# Altium schematic sheet micro.SchDoc
size A4; SheetNumber: 1; SheetTotal: 2; SPICEModelCacheOPHJYIUV: <root> / <DocumentId>OPHJYIUV</DocumentId> / <CacheFrame Number="0"> / <Model Name="cap" Kind="MDL"> / <Text>*Default semiconductor capacitor / .MODEL CAP C()</Text> / </Model> / </CacheFrame> / </root>
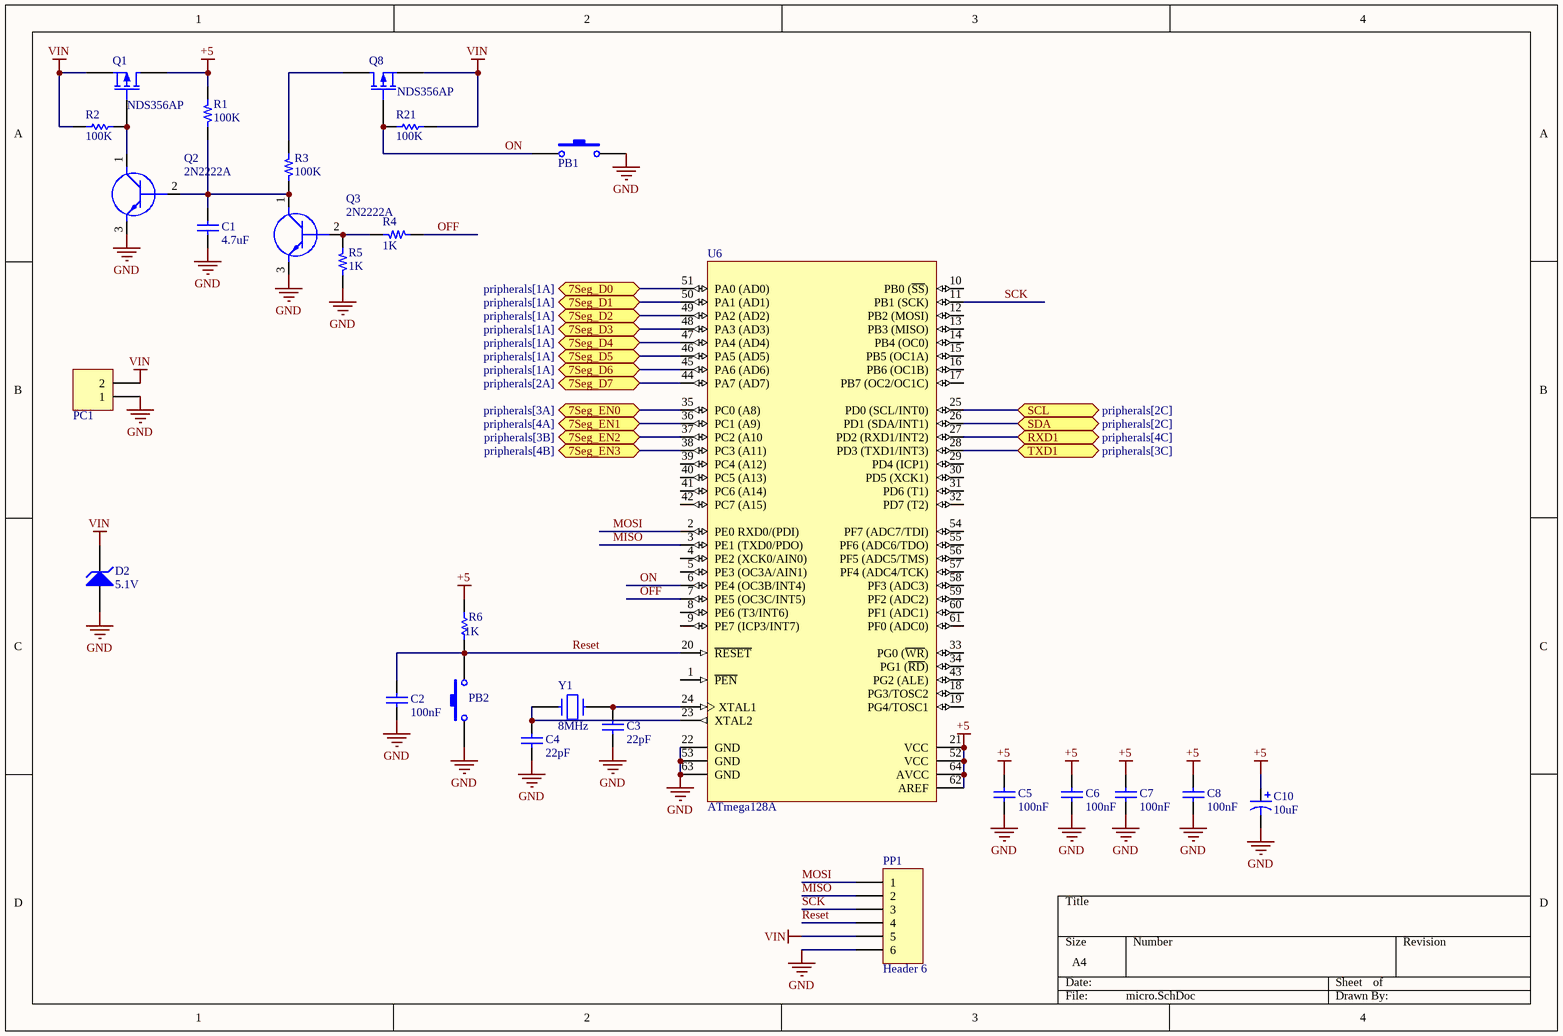
[diagram p0: micro.SchDoc]

## Parts
C1  value 4.7uF  [CAP0805]  (hidden comment: cap 4.7uF)
C2  value 100nF  [CAP0805]  (hidden comment: cap 100nF)
C3  value 22pF  [CAP0805]  (hidden comment: cap 22pF)
C4  value 22pF  [CAP0805]  (hidden comment: cap 22pF)
C5  value 100nF  [CAP0805]  (hidden comment: cap 100nF)
C6  value 100nF  [CAP0805]  (hidden comment: cap 100nF)
C7  value 100nF  [CAP0805]  (hidden comment: cap 100nF)
C8  value 100nF  [CAP0805]  (hidden comment: cap 100nF)
C10  value 10uF  [CAP0805]  (hidden comment: cap 10uF)
D2  5.1V  [Diode 1n4148 SMD]
PB1  Push-Button-tall  [tact-12mm]  (value not drawn)
PB2  Push-Button-tall  [tack-sw-3x5x6]  (value not drawn)
PC1  Power Connector  [My_ Power_Connector]  (value not drawn)
PP1  Header 6  [HDR1X6]
Q1  NDS356AP  [soT95p280x130-3n]
Q2  2N2222A  [soT95p280x130-3n]
Q3  2N2222A  [soT95p280x130-3n]
Q8  NDS356AP  [soT95p280x130-3n]
R1  100K  [RES0805]
R2  value 100K  [RES0805]  (hidden comment: Res 100K)
R3  100K  [RES0805]
R4  1K  [RES0805]
R5  1K  [RES0805]
R6  value 1K  [RES0805]  (hidden comment: Res 1K)
R21  value 100K  [RES0805]  (hidden comment: Res 100K)
U6  ATmega128A  [TQFP64_N]
Y1  8MHz  [My_Crystal]

## Ports
7Seg_D0 (bidir, see pripherals[1A]), 7Seg_D1 (bidir, see pripherals[1A]), 7Seg_D2 (bidir, see pripherals[1A]), 7Seg_D3 (bidir, see pripherals[1A]), 7Seg_D4 (bidir, see pripherals[1A]), 7Seg_D5 (bidir, see pripherals[1A]), 7Seg_D6 (bidir, see pripherals[1A]), 7Seg_D7 (bidir, see pripherals[2A]), 7Seg_EN0 (bidir, see pripherals[3A]), 7Seg_EN1 (bidir, see pripherals[4A]), 7Seg_EN2 (bidir, see pripherals[3B]), 7Seg_EN3 (bidir, see pripherals[4B]), RXD1 (bidir, see pripherals[4C]), SCL (bidir, see pripherals[2C]), SDA (bidir, see pripherals[2C]), TXD1 (bidir, see pripherals[3C])

## Nets
+5: C5.2 C6.2 C7.2 C8.2 C10.1 Q1.1(D) R1.1 R6.1 U6.21(VCC) U6.52(VCC) U6.62(AREF) U6.64(AVCC)
GND: C1.1 C2.1 C3.1 C4.1 C5.1 C6.1 C7.1 C8.1 C10.2 D2.1(A) PB1.2 PB2.1 PC1.1 PP1.6 Q2.3(E) Q3.3(E) R5.1 U6.22(GND) U6.53(GND) U6.63(GND)
VIN: D2.2(K) PC1.2 PP1.5 Q1.3(S) Q8.3(S) R2.1 R21.1
7Seg_D0: U6.51(PA0_(AD0)) ; port 7Seg_D0
7Seg_D1: U6.50(PA1_(AD1)) ; port 7Seg_D1
7Seg_D2: U6.49(PA2_(AD2)) ; port 7Seg_D2
7Seg_D3: U6.48(PA3_(AD3)) ; port 7Seg_D3
7Seg_D4: U6.47(PA4_(AD4)) ; port 7Seg_D4
7Seg_D5: U6.46(PA5_(AD5)) ; port 7Seg_D5
7Seg_D6: U6.45(PA6_(AD6)) ; port 7Seg_D6
7Seg_D7: U6.44(PA7_(AD7)) ; port 7Seg_D7
7Seg_EN0: U6.35(PC0_(A8)) ; port 7Seg_EN0
7Seg_EN1: U6.36(PC1_(A9)) ; port 7Seg_EN1
7Seg_EN2: U6.37(PC2_(A10) ; port 7Seg_EN2
7Seg_EN3: U6.38(PC3_(A11)) ; port 7Seg_EN3
MISO: PP1.2 U6.3(PE1_(TXD0/PDO))
MOSI: PP1.1 U6.2(PE0_RXD0/(PDI))
OFF: R4.1 U6.7(PE5_(OC3C/INT5))
ON: PB1.1 Q8.2(G) R21.2 U6.6(PE4_(OC3B/INT4))
Reset: C2.2 PB2.2 PP1.4 R6.2 U6.20(~{RESET})
RXD1: U6.27(PD2_(RXD1/INT2)) ; port RXD1
SCK: PP1.3 U6.11(PB1_(SCK))
SCL: U6.25(PD0_(SCL/INT0)) ; port SCL
SDA: U6.26(PD1_(SDA/INT1)) ; port SDA
TXD1: U6.28(PD3_(TXD1/INT3)) ; port TXD1
NetC1_2: C1.2 Q2.2(B) Q3.1(C) R1.2 R3.2
NetC3_2: C3.2 U6.24(XTAL1) Y1.2
NetC4_2: C4.2 U6.23(XTAL2) Y1.1
NetQ1_2: Q1.2(G) Q2.1(C) R2.2
NetQ3_2: Q3.2(B) R4.2 R5.2
NetQ8_1: Q8.1(D) R3.1

Not connected (* = marked no-connect by the designer): U6 1(~{PEN}) 4(PE2_(XCK0/AIN0)) 5(PE3_(OC3A/AIN1)) 8(PE6_(T3/INT6)) 9(PE7_(ICP3/INT7)) 10(PB0_(~{SS})) 12(PB2_(MOSI)) 13(PB3_(MISO)) 14(PB4_(OC0)) 15(PB5_(OC1A)) 16(PB6_(OC1B)) 17(PB7_(OC2/OC1C)) 18(PG3/TOSC2) 19(PG4/TOSC1) 29(PD4_(ICP1)) 30(PD5_(XCK1)) 31(PD6_(T1)) 32(PD7_(T2)) 33(PG0_(~{WR})) 34(PG1_(~{RD})) 39(PC4_(A12)) 40(PC5_(A13)) 41(PC6_(A14)) 42(PC7_(A15)) 43(PG2_(ALE)) 54(PF7_(ADC7/TDI)) 55(PF6_(ADC6/TDO)) 56(PF5_(ADC5/TMS)) 57(PF4_(ADC4/TCK)) 58(PF3_(ADC3)) 59(PF2_(ADC2)) 60(PF1_(ADC1)) 61(PF0_(ADC0))

## Library data of the parts
C1-C8 = Cap ceramic: CAP seramic
C10 = Cap Pol1: CAP seramic; Published: 8-Jun-2000; LatestRevisionDate: 17-Jul-2002; LatestRevisionNote: Re-released for DXP Platform.; PackageReference: RB7.6-15; Publisher: Altium Limited; PackageDescription: Polarized Capacitor (Radial); 2 Leads
D2 = D Zener: Zener Diode 5.1v; Published: 8-Jun-2000; LatestRevisionDate: 17-Jul-2002; LatestRevisionNote: Re-released for DXP Platform.; PackageReference: DIODE-0.7; Publisher: Altium Limited; PackageDescription: Diode, Thru-Hole; 2 Leads; 0.7 in Pin Spacing
PC1 = Power Connector: white Power Connector
PP1 = Header 6: Header, 6-Pin , female; LatestRevisionDate: 17-Jul-2002; LatestRevisionNote: Re-released for DXP Platform.; Publisher: Altium Limited
Q1 Q8 = MOSFET-P: P-Channel MOSFET SOT23; pin to pad: 1>3 2>1 3>2; Published: 8-Jun-2000; LatestRevisionDate: 17-Jul-2002; LatestRevisionNote: Re-released for DXP Platform.; PackageVersion: 1995/1996; PackageReference: E3; Publisher: Altium Limited; PackageDescription: TO, Flat Index; 3 In-Line, Axial Leads; Body Dia. 4.6mm; Lead Dia. 0.5 mm (max)
Q2 Q3 = 2N2222A: Transistor BJT NPN SMD; pin to pad: 1>3 2>1 3>2; Manufacturer_Name: Foshan Blue Rocket Elec; Datasheet Link: https://datasheet.lcsc.com/szlcsc/1901291437_Foshan-Blue-Rocket-Elec-2N2222A_C358533.pdf; Height: 4.7mm; Manufacturer_Part_Number: 2N2222A
R1 R3-R5 = Resistor: RES SMD 0603; Part Number: RCS0805100KFKEA
  R1 R3: Value: 100K
  R4 R5: Value: 1K
R2 R6 R21 = Res1: Resistor; Published: 8-Jun-2000; LatestRevisionDate: 17-Jul-2002; LatestRevisionNote: Re-released for DXP Platform.; PackageReference: AXIAL-0.3; Publisher: Altium Limited; PackageDescription: Axial Device, Thru-Hole; 2 Leads; 0.3 in Pin Spacing
U6 = ATmega128A: 8-bit AVR Microcontroller, 128KB Flash, 4KB EEPROM, 4KB SRAM, 64-pin TQFP, Industrial Grade (-40°C to 85°C); Published: 1-Apr-2010; DatasheetVersion: revE, Feb-2010; PackageVersion: revB, Oct-2001; PackageReference: 64A; Publisher: Altium Limited; PackageDescription: 64-Pin Plastic Thin Profile Quad Flat Pack, 14 x 14 x 1.0 mm Body, 0.8 mm Pitch (TQFP); Supplier 1: Digi-Key; Supplier Part Number 1: ATMEGA128A-AU-ND; Supplier 2: Farnell; Supplier Part Number 2: 1773397; Supplier 3: Mouser; Supplier Part Number 3: 556-ATMEGA128A-AU; Code_JEDEC: MS-026-AEB; ComponentLink1Description: Manufacturer Link; ComponentLink1URL: http://www.atmel.com/products/avr/default.asp?; ComponentLink2Description: ATmega128A Datasheet; ComponentLink2URL: http://www.atmel.com/dyn/resources/prod_documents/doc8151.pdf; ComponentLink3Description: ATmega128A Summary; ComponentLink3URL: http://www.atmel.com/dyn/resources/prod_documents/8151S.pdf; ComponentLink4Description: Atmel.com Home; ComponentLink4URL: http://www.atmel.com
Y1 = CRYSTAL